# Altium schematic sheet PARK_COUNTER_PT1_1.SchDoc: UFABC PARK COUNTER
size A4; ApprovedBy: Muriel Costa; CheckedBy: Muriel Costa; Author: Muriel Costa; CompanyName: Muriel Costa; DrawnBy: Muriel Costa; Organization: UFABC - UNIVERSIDADE; Address1: Av. dos Estados, 5001; Address2: SP-Brasil; Revision: PT1; SheetNumber: 1; SheetTotal: 2
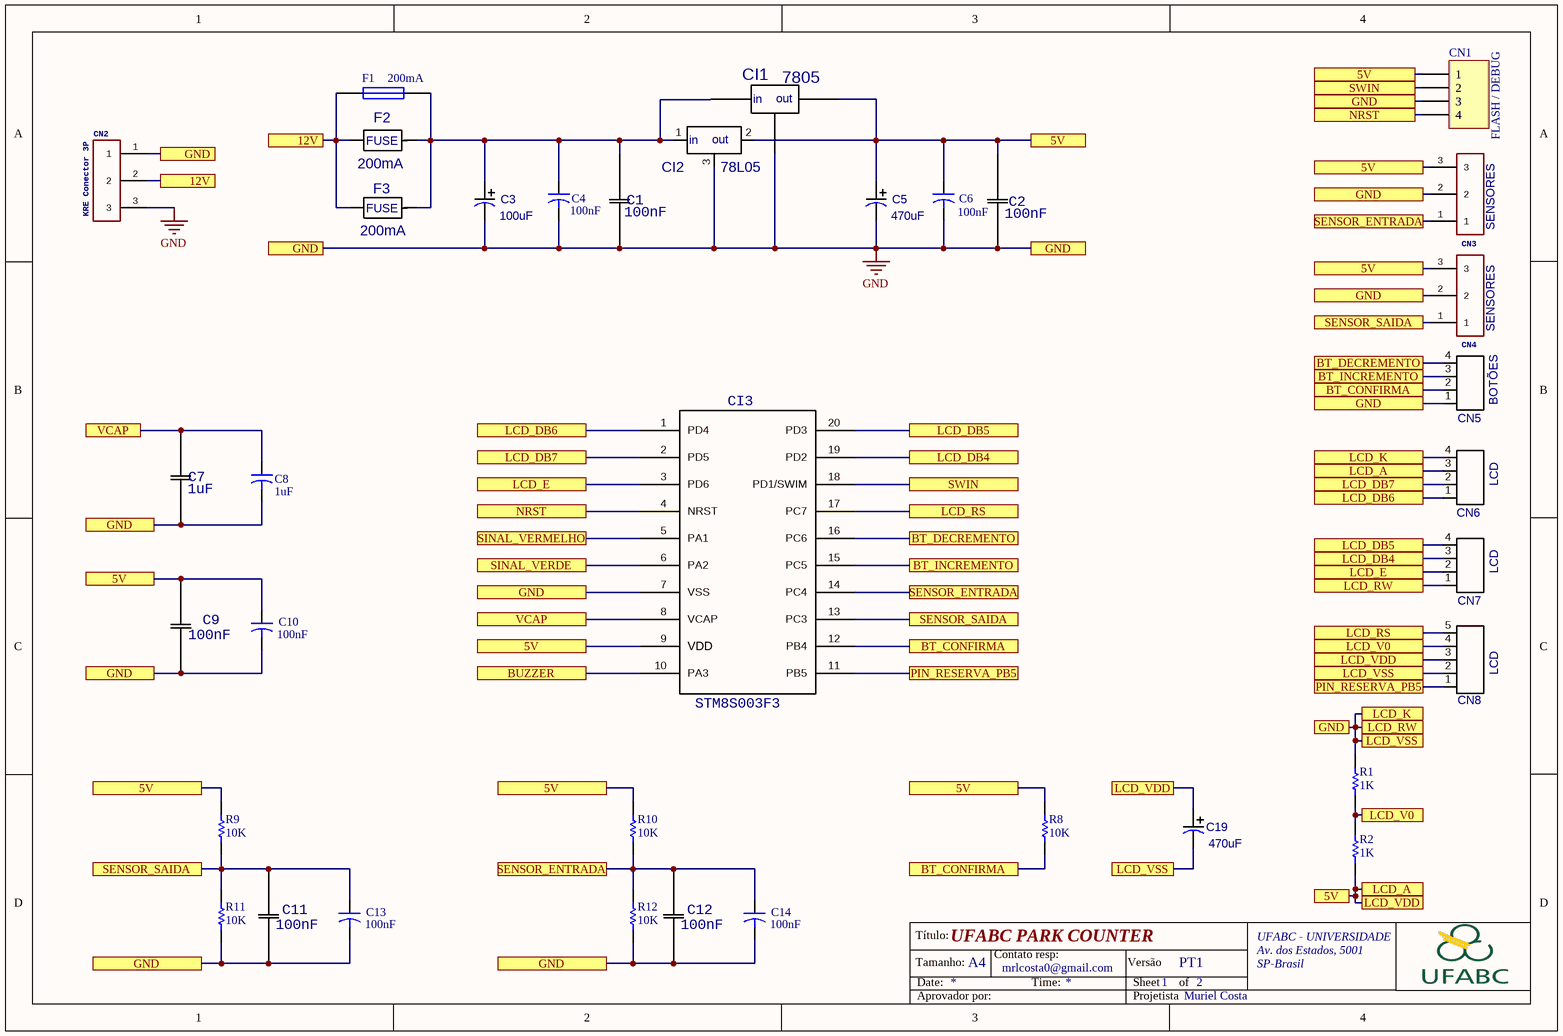
[diagram p0: PARK_COUNTER_PT1_1.SchDoc]

## Parts
C1  value 100nF  [C0603]  (hidden comment: C0603)
C2  value 100nF  [C0603]  (hidden comment: C0603)
C3  value 100uF  [C_ELET_D8P5/3.5]  (hidden comment: C_ELET_D8P5_35)
C4  value 100nF  [CAPR5-4X5]  (hidden comment: Cap2)
C5  value 470uF  [C_ELET_D8P5/3.5]  (hidden comment: C_ELET_D8P5_35)
C6  value 100nF  [CAPR5-4X5]  (hidden comment: Cap2)
C7  value 1uF  [C0603]  (hidden comment: C0603)
C8  value 1uF  [CAPR5-4X5]  (hidden comment: Cap2)
C9  value 100nF  [C0603]  (hidden comment: C0603)
C10  value 100nF  [CAPR5-4X5]  (hidden comment: Cap2)
C11  value 100nF  [C0603]  (hidden comment: C0603)
C12  value 100nF  [C0603]  (hidden comment: C0603)
C13  value 100nF  [CAPR5-4X5]  (hidden comment: Cap2)
C14  value 100nF  [CAPR5-4X5]  (hidden comment: Cap2)
C19  value 470uF  [C_ELET_D8P5/3.5]  (hidden comment: C_ELET_D8P5_35)
CI1  7805  [CI_7805_TO220_V]
CI2  78L05  [TO92_78L05]
CI3  value STM8S003F3  [TSSOP20]  (hidden comment: CI_STM8S003F3_TSSOP20)
CN1  FLASH / DEBUG  [HDR1X4]
CN2  KRE Conector 3P  [KRE-3P]
CN3  SENSORES  [KRE-3P]
CN4  SENSORES  [KRE-3P]
CN5  value BOTÕES  [CON_BP1X4_180]  (hidden comment: CON_BP1X4_180)
CN6  value LCD  [CON_BP1X4_180]  (hidden comment: CON_BP1X4_180)
CN7  value LCD  [CON_BP1X4_180]  (hidden comment: CON_BP1X4_180)
CN8  value LCD  [CON_BP1X5_180]  (hidden comment: CON_BP1X5_180)
F1  200mA  [PIN-W2/E2.8]
F2  value 200mA  [MINI_FUSE_BOARD_GLASS]  (hidden comment: MINI_FUSE_BOARD_GLASS)
F3  value 200mA  [fuse_board_suporte]  (hidden comment: MINI_FUSE_BOARD_SUP_GLASS)
R1  value 1K  [AXIAL-0.3]  (hidden comment: Res1)
R2  value 1K  [AXIAL-0.3]  (hidden comment: Res1)
R8  value 10K  [AXIAL-0.3]  (hidden comment: Res1)
R9  value 10K  [AXIAL-0.3]  (hidden comment: Res1)
R10  value 10K  [AXIAL-0.3]  (hidden comment: Res1)
R11  value 10K  [AXIAL-0.3]  (hidden comment: Res1)
R12  value 10K  [AXIAL-0.3]  (hidden comment: Res1)

## Ports
5V, 12V, BT_CONFIRMA, BT_DECREMENTO, BT_INCREMENTO, BUZZER, GND, LCD_A, LCD_DB4, LCD_DB5, LCD_DB6, LCD_DB7, LCD_E, LCD_K, LCD_RS, LCD_RW, LCD_V0, LCD_VDD, LCD_VSS, NRST, PIN_RESERVA_PB5, SENSOR_ENTRADA, SENSOR_SAIDA, SINAL_VERDE, SINAL_VERMELHO, SWIN, VCAP

## Nets
GND: C1.1 C2.1 C3.1 C4.2 C5.1 C6.2 C7.1 C8.2 C9.1 C10.2 C11.1 C12.1 C13.2 C14.2 C19.1 CI1.3 CI2.3(gnd) CI3.7(VSS) CN1.3 CN2.1 CN2.3 CN3.2 CN4.2 CN5.1 CN6.4 CN7.1 CN8.2 R1.2 R11.1 R12.1 ; port GND, port LCD_K, port LCD_RW, port LCD_VSS
5V: C2.2 C5.2 C6.1 C9.2 C10.1 C19.2 CI1.2 CI2.2(out) CI3.9(VDD) CN1.1 CN3.3 CN4.3 CN6.3 CN8.3 R2.1 R8.2 R9.2 R10.2 ; port 5V, port LCD_A, port LCD_VDD
12V: CN2.2 F1.1 F2.2 F3.2 ; port 12V
BT_CONFIRMA: CI3.12(PB4) CN5.2 R8.1 ; port BT_CONFIRMA
BT_DECREMENTO: CI3.16(PC6) CN5.4 ; port BT_DECREMENTO
BT_INCREMENTO: CI3.15(PC5) CN5.3 ; port BT_INCREMENTO
BUZZER: CI3.10(PA3) ; port BUZZER
LCD_DB4: CI3.19(PD2) CN7.3 ; port LCD_DB4
LCD_DB5: CI3.20(PD3) CN7.4 ; port LCD_DB5
LCD_DB6: CI3.1(PD4) CN6.1 ; port LCD_DB6
LCD_DB7: CI3.2(PD5) CN6.2 ; port LCD_DB7
LCD_E: CI3.3(PD6) CN7.2 ; port LCD_E
LCD_RS: CI3.17(PC7) CN8.5 ; port LCD_RS
LCD_V0: CN8.4 R1.1 R2.2 ; port LCD_V0
NRST: CI3.4(NRST) CN1.4 ; port NRST
PIN_RESERVA_PB5: CI3.11(PB5) CN8.1 ; port PIN_RESERVA_PB5
SENSOR_ENTRADA: C12.2 C14.1 CI3.14(PC4) CN3.1 R10.1 R12.2 ; port SENSOR_ENTRADA
SENSOR_SAIDA: C11.2 C13.1 CI3.13(PC3) CN4.1 R9.1 R11.2 ; port SENSOR_SAIDA
SINAL_VERDE: CI3.6(PA2) ; port SINAL_VERDE
SINAL_VERMELHO: CI3.5(PA1) ; port SINAL_VERMELHO
SWIN: CI3.18(PD1/SWIM) CN1.2 ; port SWIN
VCAP: C7.2 C8.1 CI3.8(VCAP) ; port VCAP
NetC1_2: C1.2 C3.2 C4.1 CI1.1 CI2.1(in) F1.2 F2.1 F3.1

Not connected (* = marked no-connect by the designer): C3 3; C5 3; C19 3; F2 3 4; F3 3 4

## Notes on the sheet
- Título:
- Tamanho:
- Date:
- A4
- Contato resp:
- mrlcosta0@gmail.com
- Time:
- Versão
- Sheet
- of
- Aprovador por:
- Projetista
- (in symbol CI_7805_TO220_V) in; out
- (in symbol fuse_board_glass) FUSE
- (in symbol fuse_board_suporte) FUSE

## Library data of the parts
C1 C2 C7 C9 C11 C12 = C0603: Capacitor
C4 C6 C8 C10 C13 C14 = Cap2: Capacitor; Published: 23-Sep-2002; PackageReference: CAPR5-4X5; Publisher: Altium Limited; PackageDescription: Capacitor; 2 Leads
CI1 = CI_7805_TO220_V: Part Number: 004.02.00002; Value: {Value}
CI2 = CI_78L05_TO92: Glass Zener Diode, 500 Milliwatt; Part Number: 004.02.00003; Value: 78L05
CI3 = CI_STM8S003F3_TSSOP20: Part Number: 004.07.00026
CN1 = Header 4: Header, 4-Pin; LatestRevisionDate: 17-Jul-2002; LatestRevisionNote: Re-released for DXP Platform.; Publisher: Altium Limited
CN2-CN4 = KRE-3P: GateName_1: G$1; SymbolName_1: KRE-3P; LibraryName: kre; DeviceSetName: KRE-3P; Package: KRE-3P
CN5-CN7 = CON_BP1X4_180: Capacitor
F1 = Fuse 1: Fuse; Published: 8-Jun-2000; LatestRevisionDate: 17-Jul-2002; LatestRevisionNote: Re-released for DXP Platform.; PackageReference: PIN-W2/E2.8; Publisher: Altium Limited; PackageDescription: Thru-Hole; 2 Leads
F2 = fuse_board_glass
F3 = fuse_board_suporte
R1 R2 R8-R12 = Res1: Resistor; Published: 8-Jun-2000; LatestRevisionDate: 17-Jul-2002; LatestRevisionNote: Re-released for DXP Platform.; PackageReference: AXIAL-0.3; Publisher: Altium Limited; PackageDescription: Axial Device, Thru-Hole; 2 Leads; 0.3 in Pin Spacing